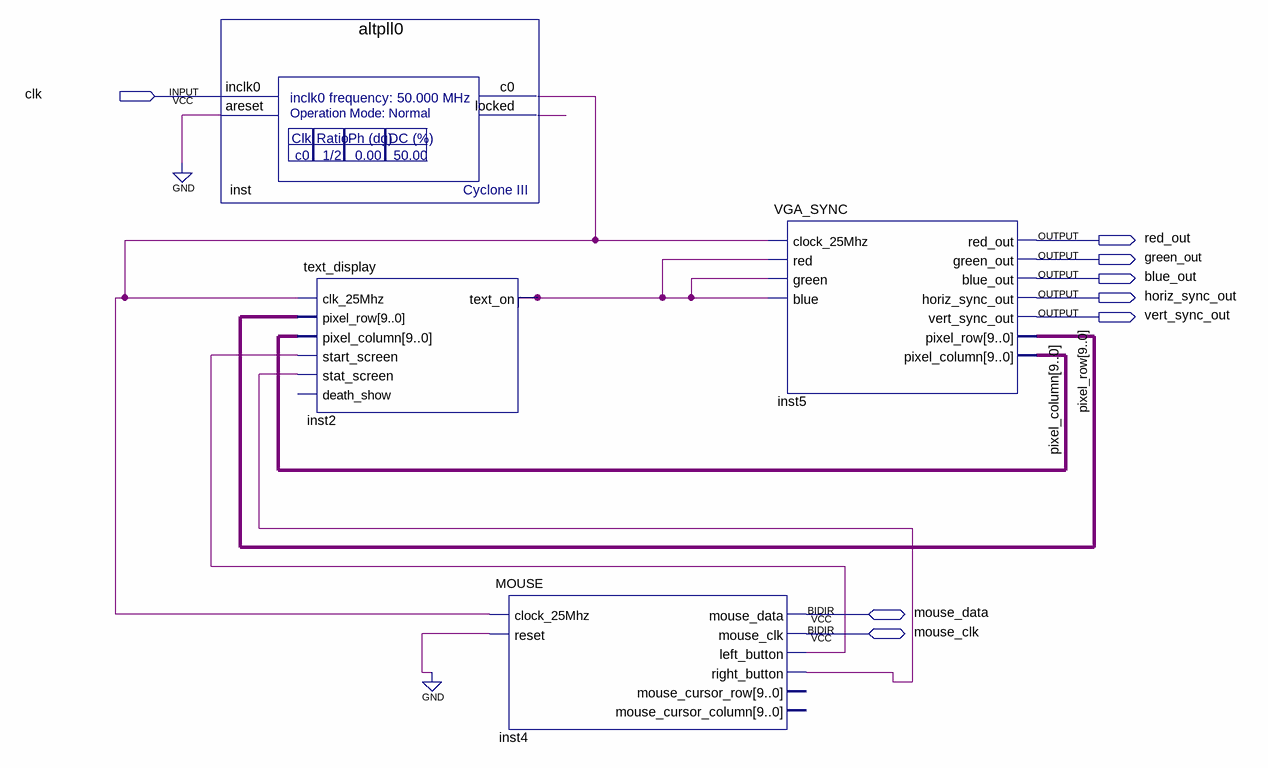
[diagram p0: schematic sheet]
// Quartus schematic VGAExample.bdf as structural Verilog: 4 symbols, 8 pins
module VGAExample (
  input  clk,
  inout  mouse_data,
  inout  mouse_clk,
  output red_out,
  output green_out,
  output blue_out,
  output horiz_sync_out,
  output vert_sync_out
);

  wire inst2_text_on, inst4_left_button, inst4_right_button, inst_c0, inst_locked;
  wire [9:0] pixel_column, pixel_row;

  altpll0 inst (.inclk0(clk), .areset(1'b0), .c0(inst_c0), .locked(inst_locked));
  text_display inst2 (
    .clk_25Mhz(inst_c0), .pixel_row(pixel_row), .pixel_column(pixel_column),
    .start_screen(inst4_left_button), .stat_screen(inst4_right_button), .text_on(inst2_text_on));  // open: death_show
  MOUSE inst4 (
    .clock_25Mhz(inst_c0), .reset(1'b0), .left_button(inst4_left_button), .right_button(inst4_right_button),
    .mouse_data(mouse_data), .mouse_clk(mouse_clk));  // open: mouse_cursor_row, mouse_cursor_column
  VGA_SYNC inst5 (
    .clock_25Mhz(inst_c0), .red(inst2_text_on), .green(inst2_text_on), .blue(inst2_text_on),
    .red_out(red_out), .green_out(green_out), .blue_out(blue_out), .horiz_sync_out(horiz_sync_out),
    .vert_sync_out(vert_sync_out), .pixel_row(pixel_row), .pixel_column(pixel_column));
endmodule
